# EAGLE design TRAFFIC LIGHT (EAGLE 9.6.2)
CNAME: TRAFFIC LIGHT CIRCUIT SCHEMATIC; CREVISION: V.1.0; DESIGNER: AZFAR ZAQUAN BIN ASFAR
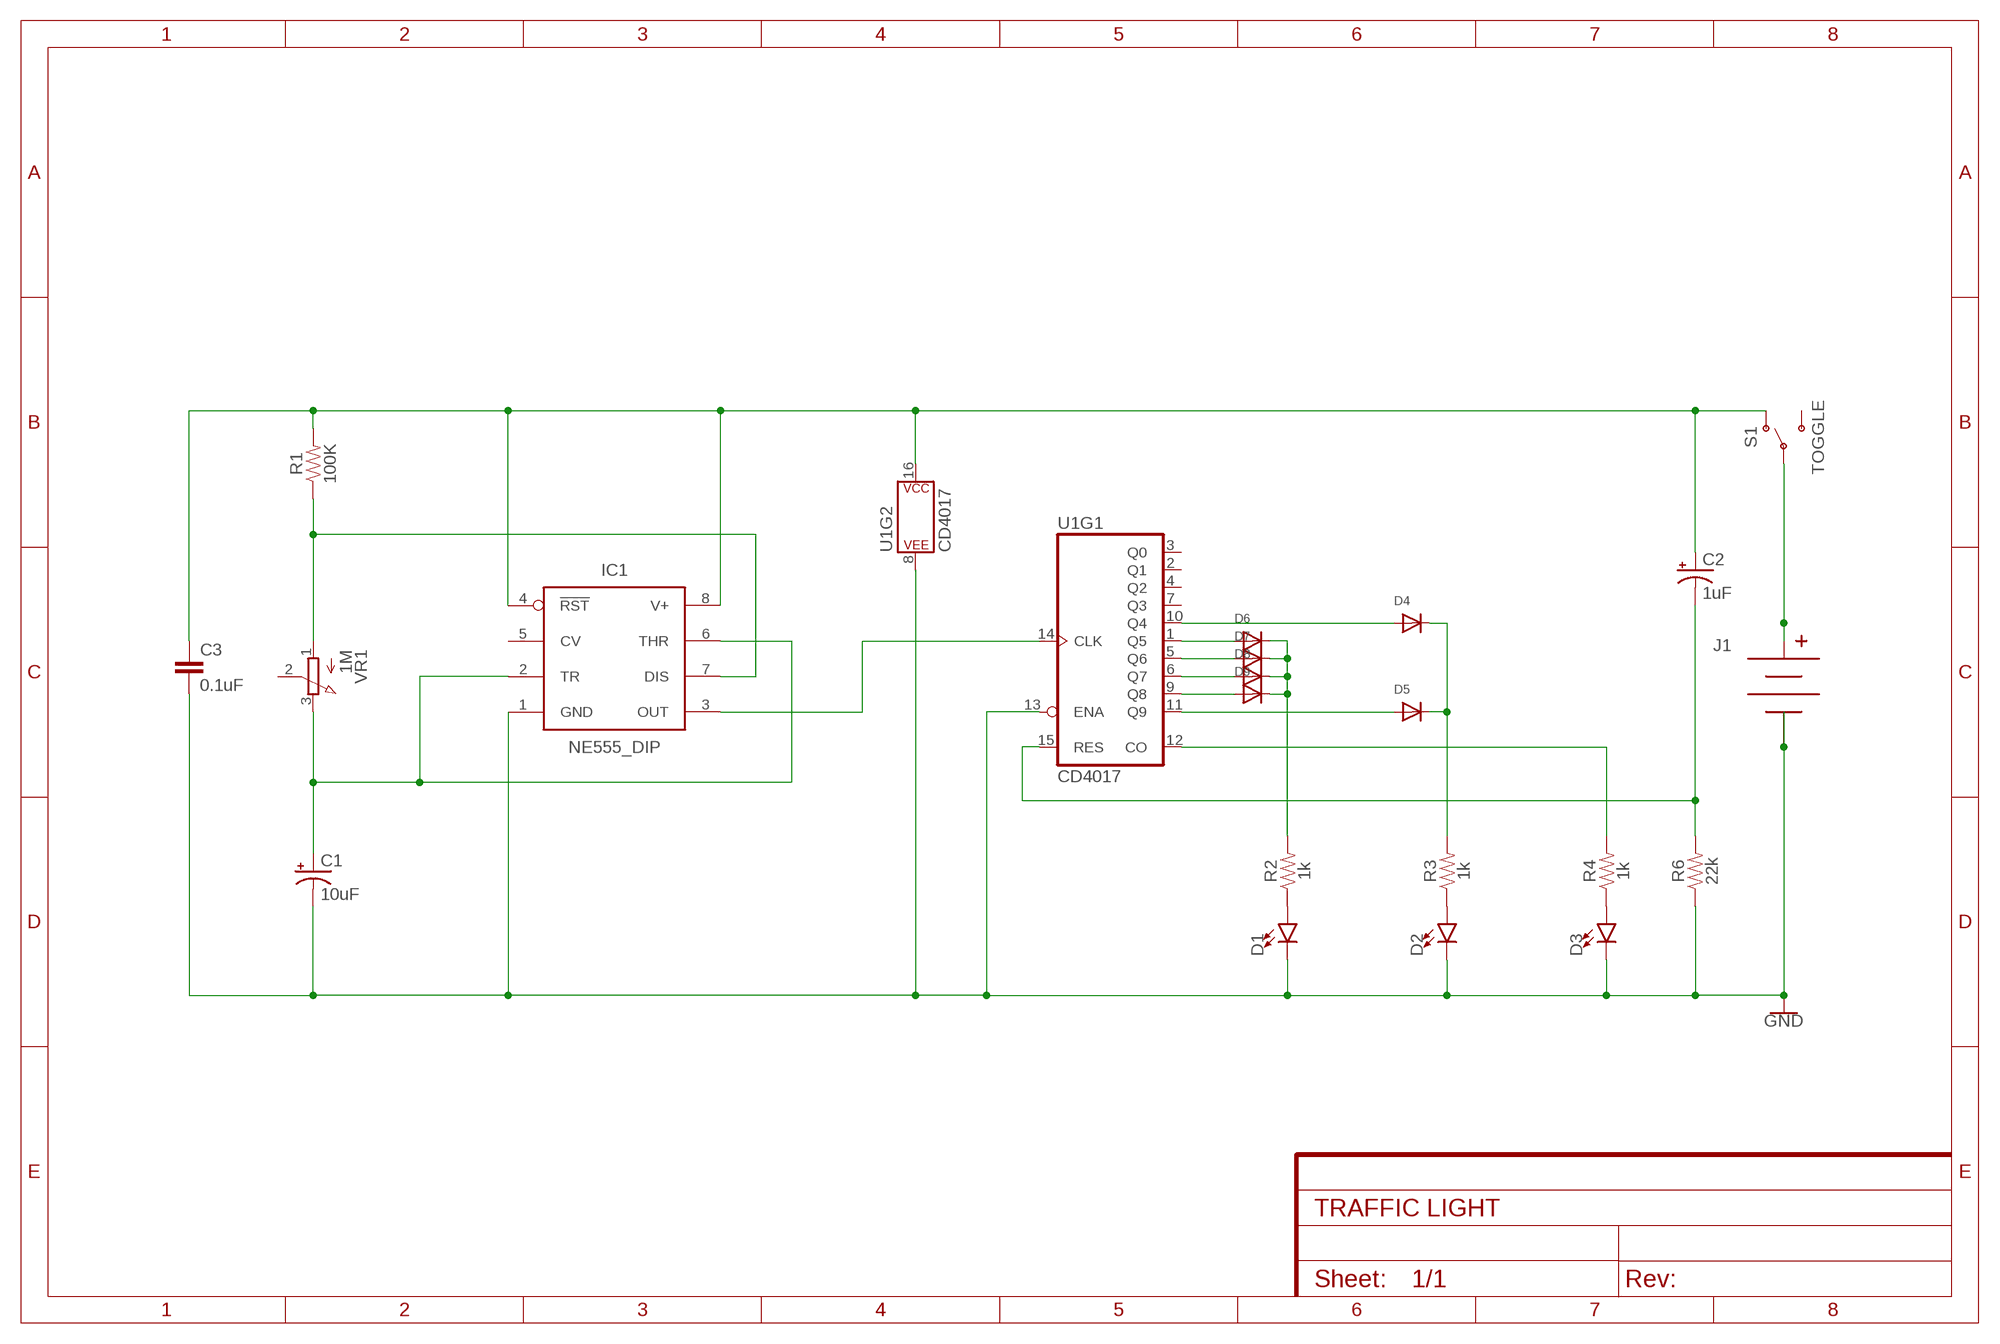
[diagram p0: schematic, sheet 1]

## Parts
C1  10uF  CPOL-USE5-5  [E5-5]
C2  1uF  CPOL-USE5-5  [E5-5]
C3  0.1uF  0.1UF-KIT-EZ-50V-20%  [CAP-PTH-SMALL-KIT]
D1  LED5MM  [LED_5MM]
D2  LED5MM  [LED_5MM]
D3  LED5MM  [LED_5MM]
D4  DIODEDO-1N4148  [DO-1N4148]
D5  DIODEDO-1N4148  [DO-1N4148]
D6  DIODEDO-1N4148  [DO-1N4148]
D7  DIODEDO-1N4148  [DO-1N4148]
D8  DIODEDO-1N4148  [DO-1N4148]
D9  DIODEDO-1N4148  [DO-1N4148]
IC1  NE555_DIP  [DIP826W53P254L959H508Q8B]
J1  BC9VPC  [BC9VPC]
R1  100K  1KOHM-HORIZ-1/4W-1%  [AXIAL-0.3]
R2  1k  1KOHM-HORIZ-1/4W-1%  [AXIAL-0.3]
R3  1k  1KOHM-HORIZ-1/4W-1%  [AXIAL-0.3]
R4  1k  1KOHM-HORIZ-1/4W-1%  [AXIAL-0.3]
R6  22k  1KOHM-HORIZ-1/4W-1%  [AXIAL-0.3]
S1  TOGGLE  [SWITCH-SPDT-PTH-8.5X3.7MM]
U1  CD4017  [DIP16]
VR1  1M  3RP/1610N  [3RP/1610N]

## Nets
GND: C1.- C3.2 D1.K(C) D2.K(C) D3.K(C) IC1.1(GND) J1.V- R6.P$1 U1.8(P$V-) U1.13(ENA)
N$1: D1.A R2.P$1
N$2: D2.A R3.P$1
N$3: D3.A R4.P$1
N$5: IC1.7(DIS) R1.P$1 VR1.1(A)
N$6: D4.A U1.10(Q4)
N$7: IC1.3(OUT) U1.14(CLK)
N$8: C1.+ IC1.2(TR) IC1.6(THR) VR1.3(E)
N$9: D5.A U1.11(Q9)
N$10: D4.C D5.C R3.P$2
N$11: D6.A U1.1(Q5)
N$12: D7.A U1.5(Q6)
N$13: C2.+ C3.1 IC1.4(!RST) IC1.8(V+) R1.P$2 S1.1(O) U1.16(P$V+)
N$14: R4.P$2 U1.12(CO)
N$15: D8.A U1.6(Q7)
N$16: D9.A U1.9(Q8)
N$17: D6.C D7.C D8.C D9.C R2.P$2
N$18: C2.- R6.P$2 U1.15(RES)
N$19: J1.V+ S1.2(P)
Unconnected: IC1.5(CV) S1.3(S) U1.2(Q1) U1.3(Q0) U1.4(Q2) U1.7(Q3) VR1.2(S)

## Library data of the parts
C1 C2 = resistor:CPOL-US: POLARIZED CAPACITOR, American symbol
C3 = SparkFun-Capacitors:0.1UF: 0.1µF ceramic capacitors A capacitor is a passive two-terminal electrical component used to store electrical energy temporarily in an electric field.; PROD_ID: CAP-08370
D1-D3 = SparkFun-LED:LED: LED (Generic) Standard schematic elements and footprints for 5mm, 3mm, 1206, and 0603 sized LEDs. Generic LEDs with no color specified.
D4-D9 = adafruit:DIODE: Diode SMADIODE - SMA Surface Mount Package 20V 1A Schottky Diode Digikey: 641-1014-6-ND DO-1N4148 - Through Hole Small Current Diode SOD-123 20V 1 A (.5mV Vf) Schottky Diode - Digikey: MBRX120TPMSCT-ND SOD-323 10V 570mA (.38mV Vf, 3ns) Schottky Diode - Digikey: ZLLS410CT-ND SOD-523 30V 30mA Schottky Diode (RB751S-40TE61) - Digikey: RB751S-40TE61CT-ND SOT23-R/W - SOT23 Package (R = Solder Paste/Reflow Ovens, W = Hand-Soldering) BAT54Film 40V 300mA - Digikey: 497-7162-1-ND
IC1 = IC_Clock-Timing:*555: TIMER 555 General purpose precision timers NE555 : Texas Datasheet <http://www.ti.com/general/docs/suppproductinfo.tsp?distId=10&gotoUrl=http%3A%2F%2Fwww.ti.com%2Flit%2Fgpn%2Fne555>, Diodes Incorporated Datasheet <https://www.diodes.com/assets/Datasheets/NE555_SA555_NA555.pdf> LM555 Datasheet <http://www.ti.com/general/docs/suppproductinfo.tsp?distId=10&gotoUrl=http%3A%2F%2Fwww.ti.com%2Flit%2Fgpn%2Flm555> LMC555 Datasheet <http://www.ti.com/general/docs/suppproductinfo.tsp?distId=10&gotoUrl=http%3A%2F%2Fwww.ti.com%2Flit%2Fgpn%2Flmc555> ICM7555 : Maxim Integrated Datasheet <https://datasheets.maximintegrated.com/en/ds/ICM7555-ICM7556.pdf>, Renesas Electronics America Inc Datasheet <https://www.renesas.com/en-us/www/doc/datasheet/icm7555-56.pdf>; CATEGORY: IC_Clock-Timing; CURRENT-SUPPLY: 10mA; DESCRIPTION: IC OSC SINGLE TIMER 100KHZ 8-DIP; FREQUENCY: 100kHz; MANUFACTURER: Texas Instruments; MPN: NE555P; OPERATING_TEMP: 0°C to 70°C; PART_STATUS: Active; ROHS_COMPLIANT: ROHS3 Compliant; SUB-CATEGORY: Timer
J1 = SparkFun-Connectors:BC9VPC: 9V Battery Holder - PC Mount Standard and Kit footprints included SparkFun Products: SparkFun SparkPunk Sound Kit <https://www.sparkfun.com/products/11177> SparkFun SparkPunk Sequencer Kit <https://www.sparkfun.com/products/12707>; PROD_ID: BATT-10855
R1 R6 = SparkFun-Resistors:1KOHM: 1kΩ resistor A resistor is a passive two-terminal electrical component that implements electrical resistance as a circuit element. Resistors act to reduce current flow, and, at the same time, act to lower voltage levels within circuits. - Wikipedia; PROD_ID: RES-12182; VALUE: 1k
R2-R4 = SparkFun-Resistors:1KOHM: 1kΩ resistor A resistor is a passive two-terminal electrical component that implements electrical resistance as a circuit element. Resistors act to reduce current flow, and, at the same time, act to lower voltage levels within circuits. - Wikipedia; PROD_ID: RES-12182
S1 = Tinkercad:TOGGLE
U1 = SparkFun-IC-Logic:CD4017: 10-Out Decade Counter Datasheet <https://cdn.sparkfun.com/datasheets/Kits/cd4022b.pdf> SparkFun Products SparkFun SparkPunk Sequencer Kit <https://www.sparkfun.com/products/12707> (KIT-12707); PROD_ID: IC-11929
VR1 = pot:3RP/1610N: 16mm Potentiometer one level Source: http://www.alphapotentiometers.net/html/16mm_pot_2.html

## Board
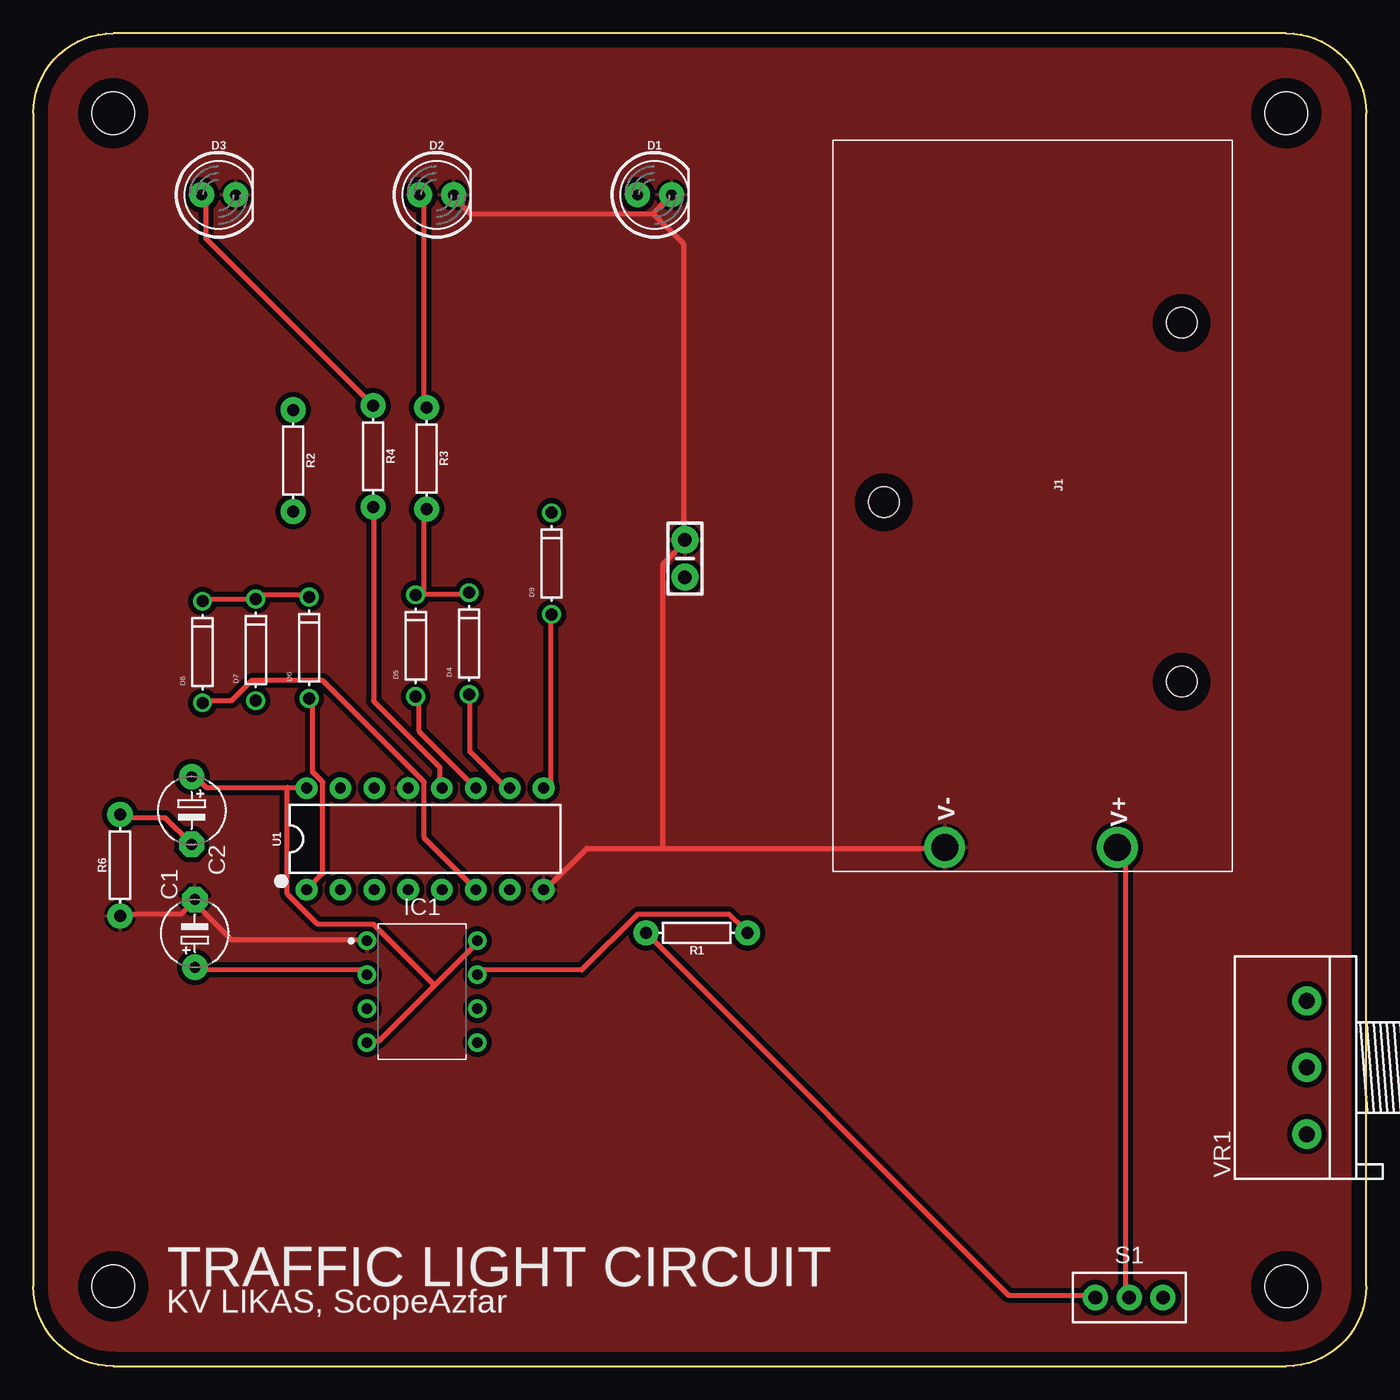
[diagram p1: board, top side]
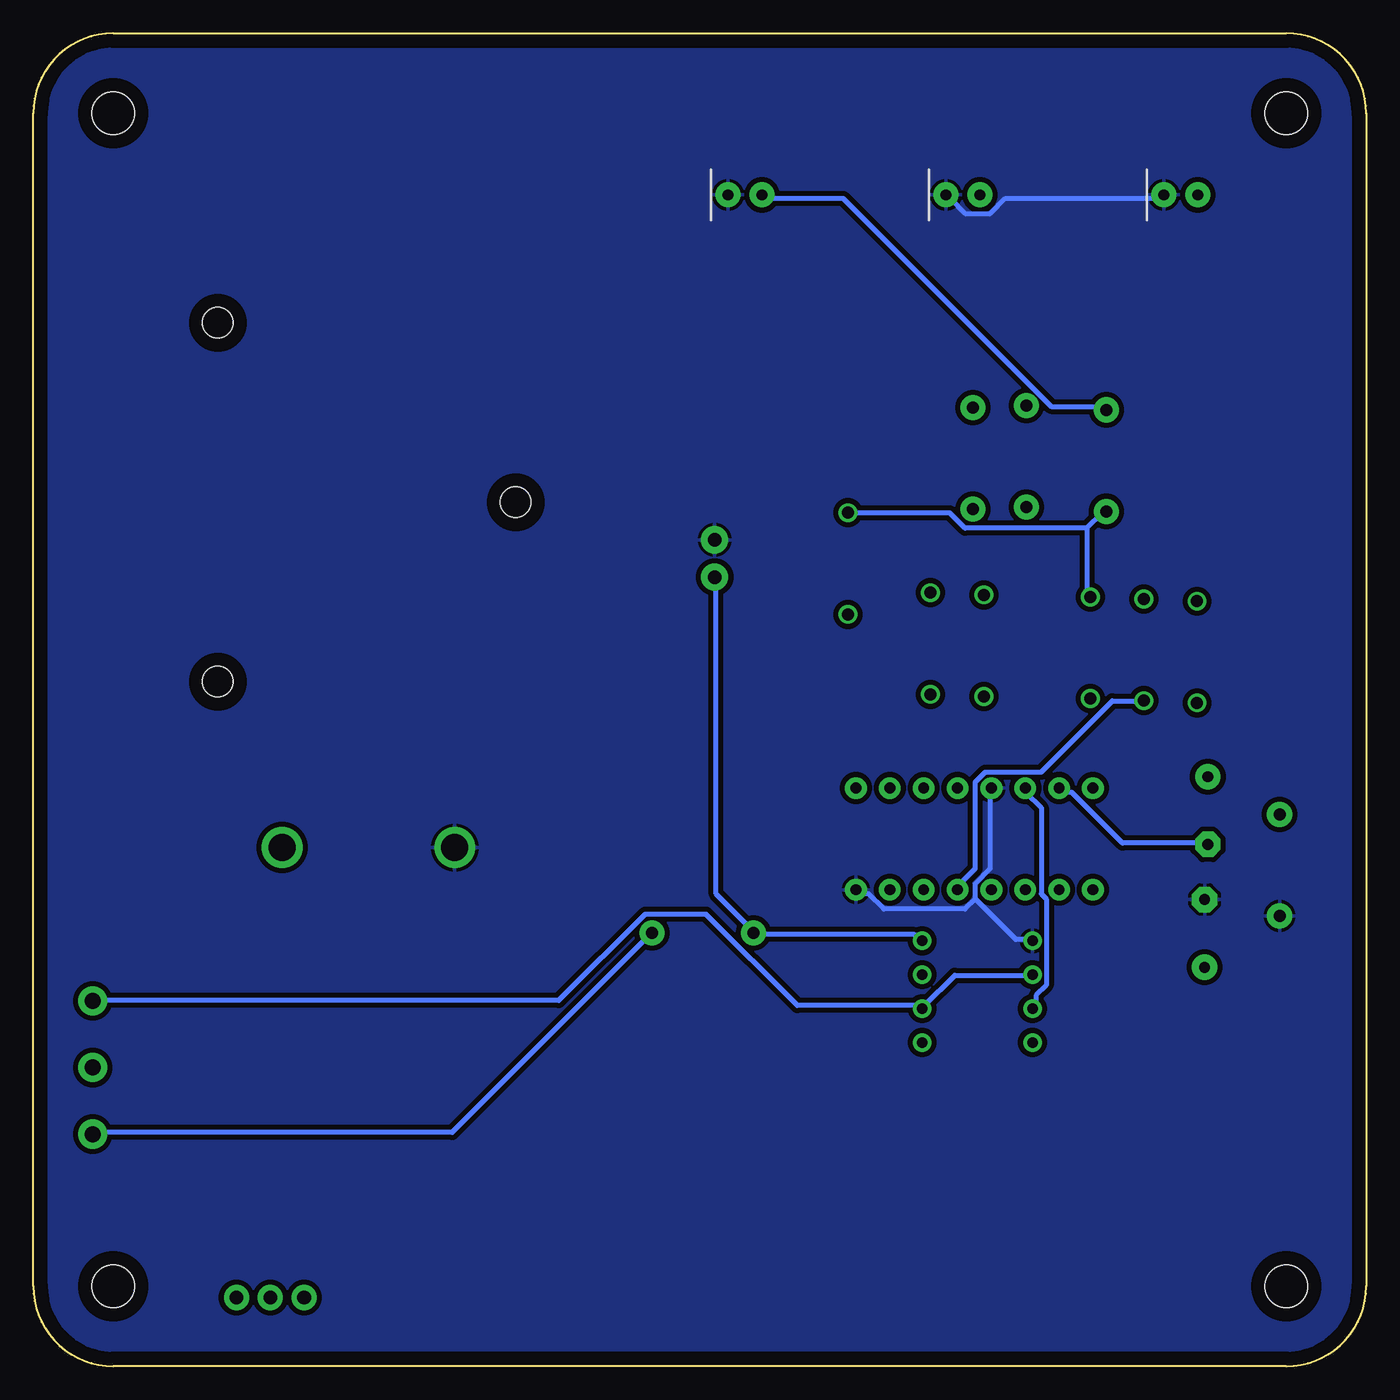
[diagram p2: board, bottom side, seen from below]

Size 100 x 100 mm. Coordinates in mm from the lower left corner, seen from the top.
Outline: 0,94 0,6 arc90 6,0 94,0 arc90 100,6 100,94 arc90 94,100 6,100 arc90 0,94
Copper layers (1*16): Top 0.035mm / dielectric 1.5mm / Bottom 0.035mm
Design rules "default *": minimum track width 15mil, minimum drill 0.35mm, track to track 15mil, track to pad 6mil, pad to pad 6mil, via to via 6mil, smd to smd 6mil, copper to edge 40mil, drill to drill 6mil, minimum pad ring 10mil, minimum via ring 8mil, stop-mask expansion 4mil, vias tented up to drill 0mil, thermal gap 10mil
Holes 3.2 mm at 94,6 94,94 6,94 6,6

### Footprints (pad centres in the part's own frame; a part is rotated, then mirrored left to right if it is on the bottom)
E5-5 = drill 0.813 pad 1.905: + -2.54,0 | drill 0.813 pad 1.905 octagon: - 2.54,0
CAP-PTH-SMALL-KIT = drill 1.016 pad 2.032: 1 -1.397,0; 2 1.397,0
LED_5MM = drill 0.813 pad 1.88: A -1.27,0; K 1.27,0
DO-1N4148 = drill 0.9: A -3.81,0; C 3.81,0
DIP826W53P254L959H508Q8B = drill 0.786 pad 1.386: 1 -4.13,3.81; 2 -4.13,1.27; 3 -4.13,-1.27; 4 -4.13,-3.81; 5 4.13,-3.81; 6 4.13,-1.27; 7 4.13,1.27; 8 4.13,3.81
BC9VPC = drill 2.032: V+ 53.086,21.336; V- 53.086,8.382 | hole 2.286: 27.178,3.81; 13.716,26.162; 40.64,26.162
AXIAL-0.3 = drill 0.9 pad 1.88: P$1 -3.81,0; P$2 3.81,0
SWITCH-SPDT-PTH-8.5X3.7MM = drill 1.016 pad 1.88: 1 -2.54,0; 2 0,0; 3 2.54,0
DIP16 = drill 0.813 pad 1.626: 1 -8.89,-3.81; 2 -6.35,-3.81; 3 -3.81,-3.81; 4 -1.27,-3.81; 5 1.27,-3.81; 6 3.81,-3.81; 7 6.35,-3.81; 8 8.89,-3.81; 9 8.89,3.81; 10 6.35,3.81; 11 3.81,3.81; 12 1.27,3.81; 13 -1.27,3.81; 14 -3.81,3.81; 15 -6.35,3.81; 16 -8.89,3.81
3RP/1610N = drill 1.2 pad 2.184: 1 -5,0; 2 0,0; 3 5,0

### Placement (x,y rotation side)
C1  12.12,32.47 90 top
C2  11.88,41.69 270 top
C3  48.88,60.6 90 top
D1  46.6,87.88 0 top
D2  30.25,87.88 0 top
D3  13.9,87.88 0 top
D4  32.69,54.22 90 top
D5  28.69,54.06 90 top
D6  20.69,53.9 90 top
D7  16.69,53.74 90 top
D8  12.69,53.58 90 top
D9  38.88,60.22 90 top
IC1  29.17,28.1 0 top
J1  60,92 270 top
R1  49.78,32.5 180 top
R2  19.5,67.94 270 top
R3  29.5,68.1 270 top
R4  25.5,68.26 270 top
R6  6.5,37.58 90 top
S1  82.22,5.15 0 top
U1  29.39,39.56 0 top
VR1  95.55,22.41 90 top

### Tracks (layer width: path | path; a pad name or v marks a point on that pad's centre or on a via)
GND
  Top 0.381: 46.48,86.49 47.62,87.63 D1.K | 46.48,86.49 32.77,86.49 31.62,87.63 D2.K | 46.48,86.49 48.77,84.2 48.77,62.1 C3.2 48.77,61.72 47.24,60.2 47.24,38.86 | IC1.1 24.77,32 14.86,32 12.19,34.67 C1.- 11.81,34.67 11.05,33.91 6.86,33.91 R6.P$1 | 47.24,38.86 41.53,38.86 38.48,35.81 U1.8 | 47.24,38.86 68.2,38.86 J1.V-
  Bottom 0.381: D3.K 15.24,87.63 27.05,87.63 28.19,86.49 30.1,86.49 31.24,87.63 D2.K | 29.34,35.05 29.34,36.2 28.19,37.34 28.19,43.05 U1.13 | 29.34,35.05 26.29,32 25.15,32 IC1.1 | 29.34,35.05 30.1,34.29 36.2,34.29 37.34,35.43 38.1,35.43 U1.8
  pour Top: -10,106 114,106 118,102 124,96 124,-10 120,-14 -18,-14 -18,98
  pour Bottom: -10,106 130,106 134,102 134,-22 -22,-22 -24,-20 -24,92
N$1
  Bottom 0.381: R2.P$1 19.81,72.01 23.62,72.01 39.24,87.63 44.96,87.63 D1.A
N$2
  Top 0.381: D2.A 29.34,87.63 29.34,72.01 R3.P$1
N$3
  Top 0.381: D3.A 12.95,87.63 12.95,84.58 25.15,72.39 R4.P$1
N$5
  Top 0.381: IC1.7 33.53,29.72 41.15,29.72 45.34,33.91 52.2,33.91 53.34,32.77 R1.P$1
  Bottom 0.381: VR1.1 95.25,17.53 68.58,17.53 53.72,32.38 R1.P$1
N$6
  Top 0.381: D4.A 32.77,50.29 32.77,46.1 35.43,43.43 U1.10
N$7
  Bottom 0.381: IC1.3 24.77,27.05 24.77,27.81 24,28.57 24,35.05 24.38,35.43 24.38,41.91 25.53,43.05 U1.14
N$8
  Top 0.381: C1.+ 12.19,29.72 24.77,29.72 IC1.2
  Bottom 0.381: IC1.2 25.15,29.34 30.86,29.34 33.15,27.05 IC1.6 33.53,27.05 42.67,27.05 49.53,33.91 54.1,33.91 60.58,27.43 95.25,27.43 VR1.3
N$9
  Top 0.381: D5.A 28.96,49.91 28.96,47.62 33.15,43.43 U1.11
N$10
  Top 0.381: 29.34,57.91 32.38,57.91 D4.C | 29.34,57.91 28.96,57.91 D5.C 29.34,57.91 | 29.34,57.91 29.34,64.01 R3.P$2
N$11
  Top 0.381: D6.A 20.95,49.91 20.95,44.58 21.72,43.81 21.72,36.96 20.57,35.81 U1.1
N$12
  Bottom 0.381: D7.A 16.76,49.91 19.05,49.91 24.38,44.58 28.57,44.58 29.34,43.81 29.34,37.34 30.86,35.81 U1.5
N$13
  Top 0.381: 19.05,43.43 12.95,43.43 12.19,44.2 C2.+ | 19.05,43.43 20.19,43.43 U1.16 | 30.1,28.57 33.15,31.62 IC1.8 | 30.1,28.57 25.91,24.38 25.15,24.38 IC1.4 | S1.1 79.63,5.33 73.15,5.33 46.1,32.38 R1.P$2 | 19.05,43.43 19.05,35.43 21.34,33.15 25.53,33.15 30.1,28.57
  Bottom 0.381: IC1.8 33.53,32 33.91,32.38 45.72,32.38 R1.P$2 46.1,32.77 48.77,35.43 48.77,59.05 C3.1
N$14
  Top 0.381: U1.12 30.48,43.43 30.48,44.96 25.53,49.91 25.53,64.39 R4.P$2
N$15
  Top 0.381: D8.A 12.95,49.91 14.86,49.91 16.38,51.44 21.72,51.44 29.34,43.81 29.34,39.62 33.15,35.81 U1.6
N$16
  Top 0.381: D9.A 38.86,56.39 38.86,43.81 38.48,43.43 U1.9
N$17
  Top 0.381: D8.C 12.95,57.53 16.38,57.53 D7.C 16.76,57.91 20.57,57.91 D6.C
  Bottom 0.381: 20.95,62.87 30.1,62.87 31.24,64.01 38.86,64.01 D9.C | 20.95,62.87 19.81,64.01 R2.P$2 | 20.95,62.87 20.95,57.91 D6.C
N$18
  Top 0.381: R6.P$2 6.86,41.15 9.91,41.15 11.81,39.24 C2.-
  Bottom 0.381: U1.15 22.86,43.05 22.1,43.05 18.29,39.24 12.19,39.24 C2.-
N$19
  Top 0.381: S1.2 81.92,5.33 81.92,38.48 81.53,38.86 J1.V+

### Text on the board
tSilk: TRAFFIC LIGHT CIRCUIT | KV LIKAS, ScopeAzfar